# Altium project hardware_V00.02.PrjPcb
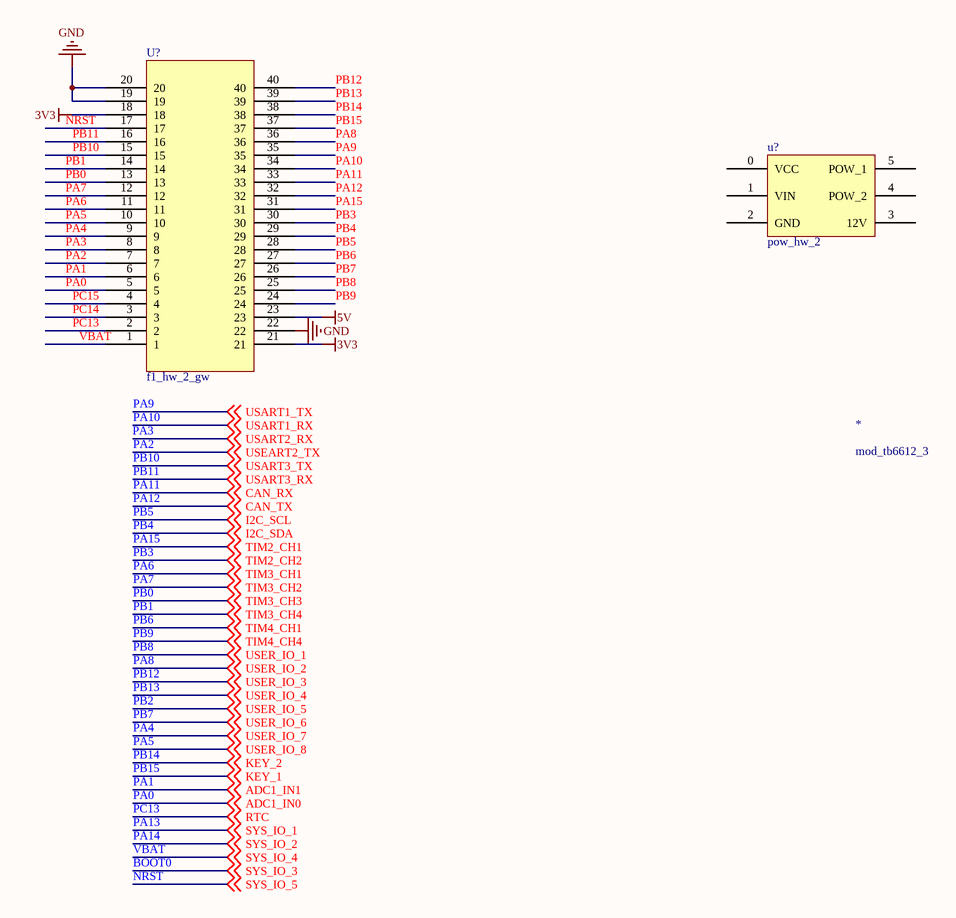
[diagram p0: hardware_V00.02.SchDoc]
1 sheet, 3 parts. Net scope: global (net labels, ports and power ports of the same name join across sheets).
Board file: project_2_V00.02.PcbDoc

## Sheet hardware_V00.02.SchDoc
size A4; SheetNumber: 1; SheetTotal: 1

### Parts
(Parts that share a designator on the sheet are numbered #1, #2 ... from top to bottom, then left to right.)
*  mod_tb6612_3  [mod_tb6612_3]
U?#1  f1_hw_2_gw  [F1_HW_2_GW]
u?#2  pow_hw_2  [pow_hw_2]

### Nets
3V3: U?#1.18 U?#1.21
5V: U?#1.23
GND: U?#1.19 U?#1.20 U?#1.22
NRST: U?#1.17 ; off-sheet SYS_IO_5  [also labelled SYS_IO_5]
PA0: U?#1.5 ; off-sheet ADC1_IN0  [also labelled ADC1_IN0]
PA1: U?#1.6 ; off-sheet ADC1_IN1  [also labelled ADC1_IN1]
PA2: U?#1.7 ; off-sheet USEART2_TX  [also labelled USEART2_TX]
PA3: U?#1.8 ; off-sheet USART2_RX  [also labelled USART2_RX]
PA4: U?#1.9 ; off-sheet USER_IO_7  [also labelled USER_IO_7]
PA5: U?#1.10 ; off-sheet USER_IO_8  [also labelled USER_IO_8]
PA6: U?#1.11 ; off-sheet TIM3_CH1  [also labelled TIM3_CH1]
PA7: U?#1.12 ; off-sheet TIM3_CH2  [also labelled TIM3_CH2]
PA8: U?#1.36 ; off-sheet USER_IO_2  [also labelled USER_IO_2]
PA9: U?#1.35 ; off-sheet USART1_TX  [also labelled USART1_TX]
PA10: U?#1.34 ; off-sheet USART1_RX  [also labelled USART1_RX]
PA11: U?#1.33 ; off-sheet CAN_RX  [also labelled CAN_RX]
PA12: U?#1.32 ; off-sheet CAN_TX  [also labelled CAN_TX]
PA15: U?#1.31 ; off-sheet TIM2_CH1  [also labelled TIM2_CH1]
PB0: U?#1.13 ; off-sheet TIM3_CH3  [also labelled TIM3_CH3]
PB1: U?#1.14 ; off-sheet TIM3_CH4  [also labelled TIM3_CH4]
PB3: U?#1.30 ; off-sheet TIM2_CH2  [also labelled TIM2_CH2]
PB4: U?#1.29 ; off-sheet I2C_SDA  [also labelled I2C_SDA]
PB5: U?#1.28 ; off-sheet I2C_SCL  [also labelled I2C_SCL]
PB6: U?#1.27 ; off-sheet TIM4_CH1  [also labelled TIM4_CH1]
PB7: U?#1.26 ; off-sheet USER_IO_6  [also labelled USER_IO_6]
PB8: U?#1.25 ; off-sheet USER_IO_1  [also labelled USER_IO_1]
PB9: U?#1.24 ; off-sheet TIM4_CH4  [also labelled TIM4_CH4]
PB10: U?#1.15 ; off-sheet USART3_TX  [also labelled USART3_TX]
PB11: U?#1.16 ; off-sheet USART3_RX  [also labelled USART3_RX]
PB12: U?#1.40 ; off-sheet USER_IO_3  [also labelled USER_IO_3]
PB13: U?#1.39 ; off-sheet USER_IO_4  [also labelled USER_IO_4]
PB14: U?#1.38 ; off-sheet KEY_2  [also labelled KEY_2]
PB15: U?#1.37 ; off-sheet KEY_1  [also labelled KEY_1]
PC13: U?#1.2 ; off-sheet RTC  [also labelled RTC]
PC14: U?#1.3
PC15: U?#1.4
VBAT: U?#1.1 ; off-sheet SYS_IO_4  [also labelled SYS_IO_4]

Not connected (* = marked no-connect by the designer): u?#2 0(VCC) 1(VIN) 2(GND) 3(12V) 4(POW_2) 5(POW_1)

### Library data of the parts
u?#2 = pow_hw_2: 两路升降压电源模块 / 6p排母*2